# Altium schematic sheet WMM 05 Main Scheme.SchDoc
size A3; Date: Not used; ApprovedBy: Not used; CheckedBy: Not used; Author: Not used; CompanyName: VR; DrawnBy: Not used; Engineer: Not used; Organization: Not used; Address1: Not used; Address2: Not used; Address3: Not used; Address4: Not used; DocumentNumber: 6; Revision: Not used; SheetNumber: 6; SheetTotal: 9; Time: Not used; ImagePath: Not used; Application_BuildNumber: Not used
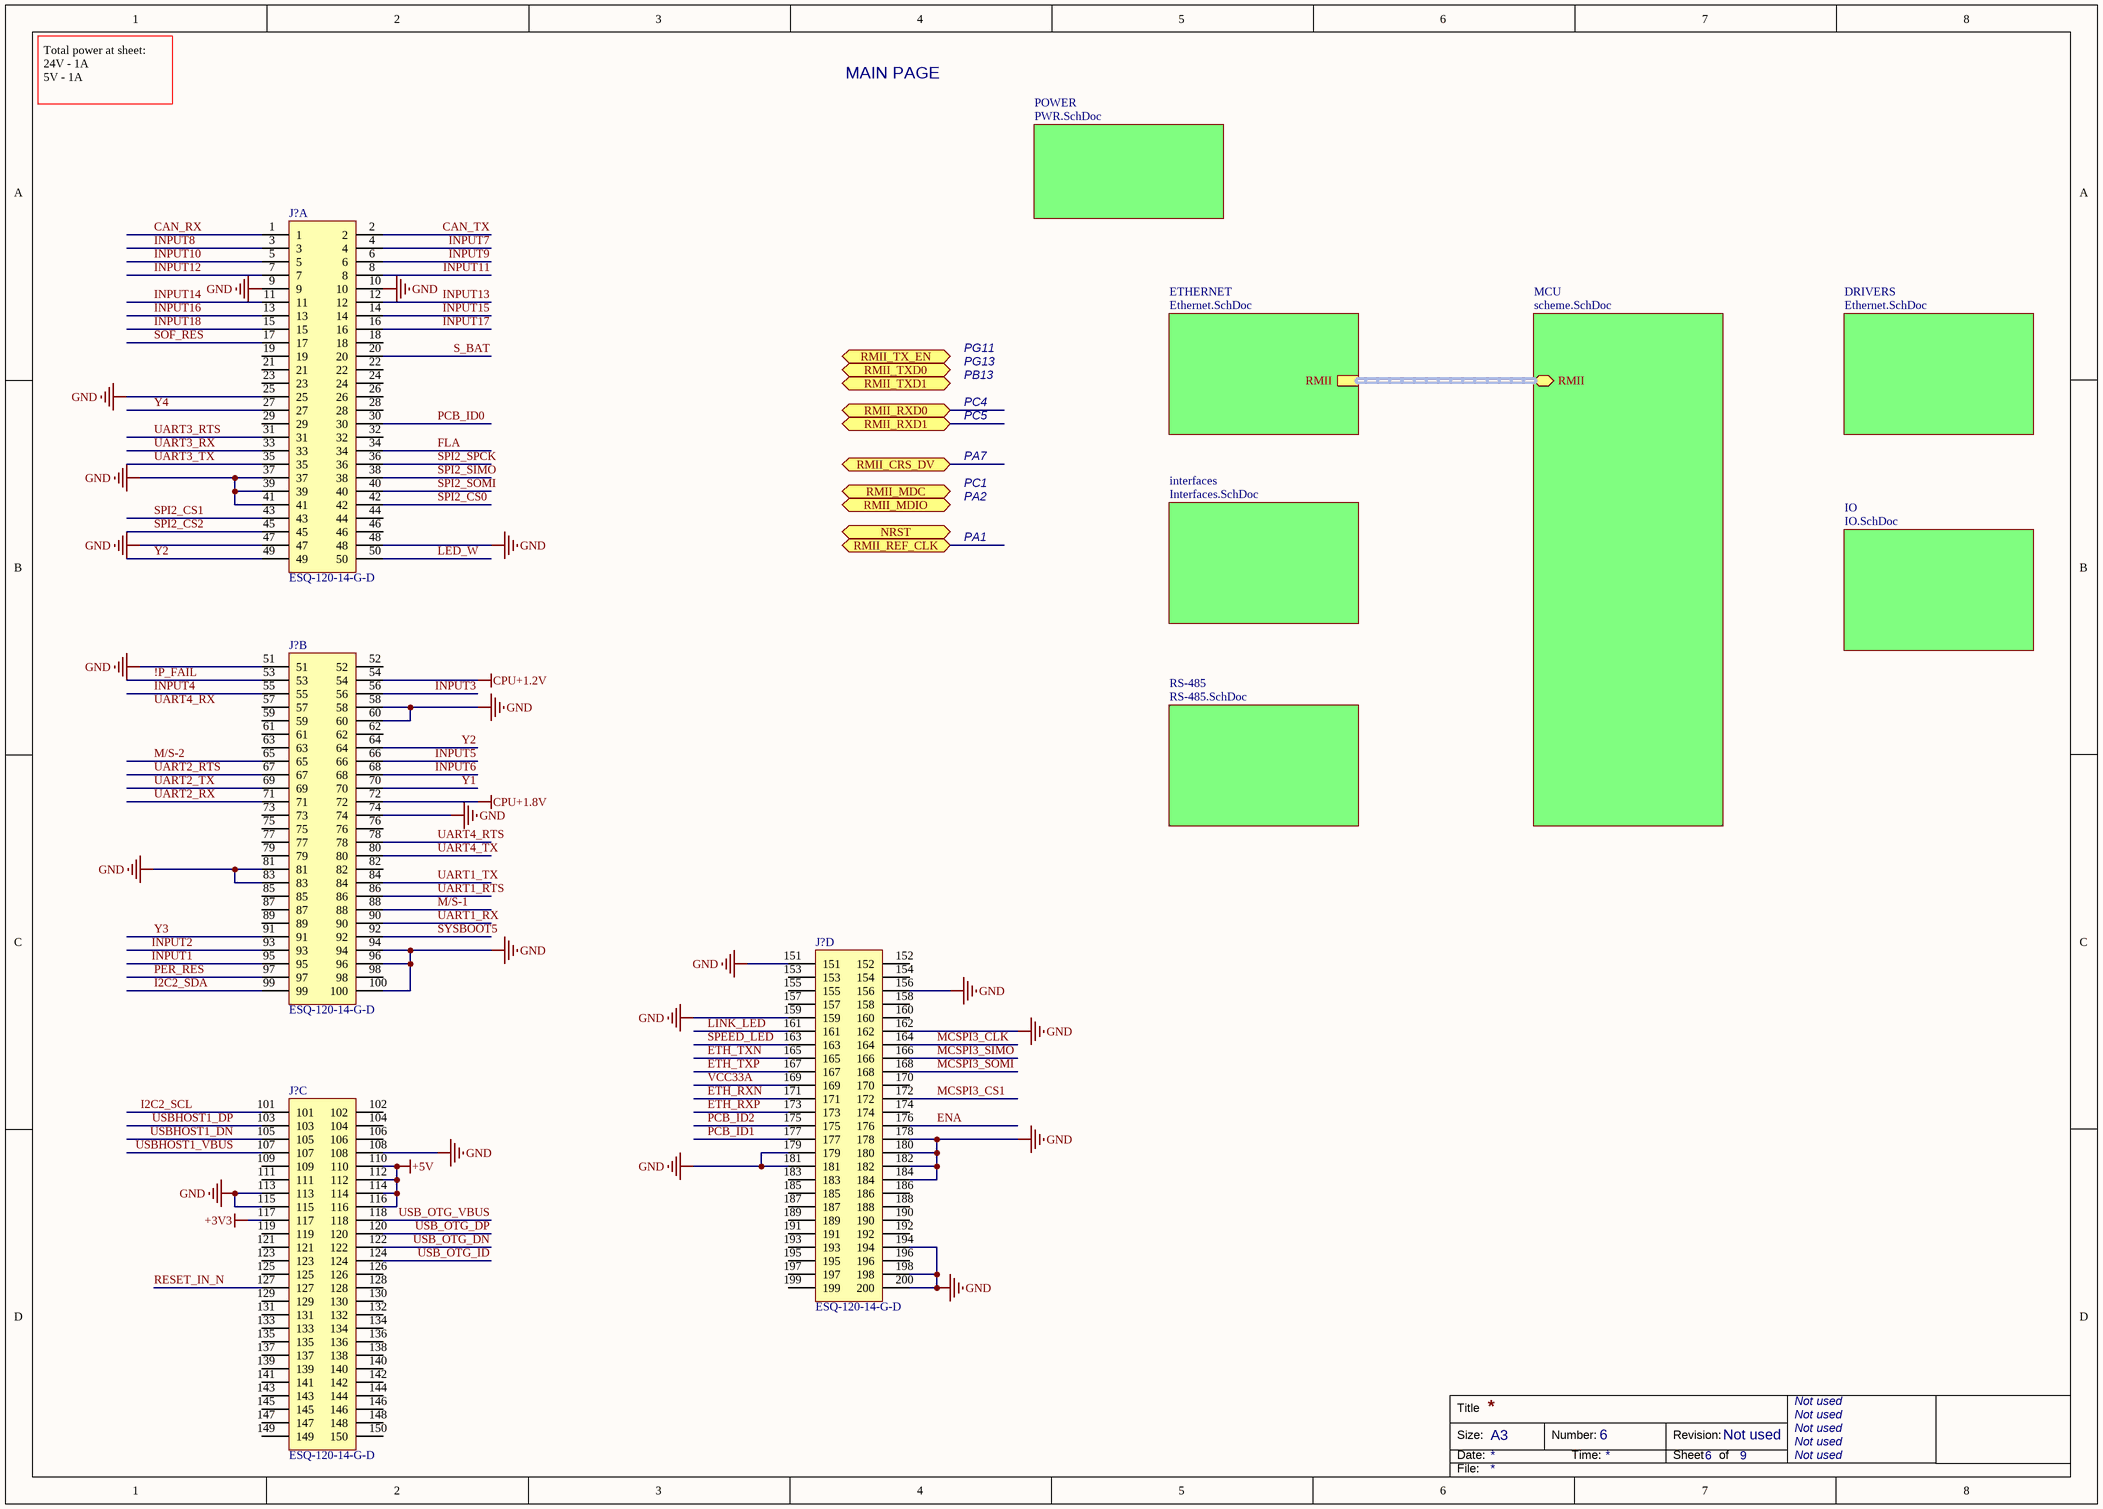
[diagram p0: WMM 05 Main Scheme.SchDoc]

## Parts
(Parts that share a designator on the sheet are numbered #1, #2 ... from top to bottom, then left to right.)
J?#1  ESQ-120-14-G-D  [SODIMM_200]  (part A of 4)
J?#2  ESQ-120-14-G-D  [SODIMM_200]  (part B of 4)
J?#3  ESQ-120-14-G-D  [SODIMM_200]  (part D of 4)
J?#4  ESQ-120-14-G-D  [SODIMM_200]  (part C of 4)

## Sub-sheets
DRIVERS = Ethernet.SchDoc: no entries
ETHERNET = Ethernet.SchDoc: RMII
interfaces = Interfaces.SchDoc: no entries
IO = IO.SchDoc: no entries
MCU = scheme.SchDoc: RMII (bidir)
POWER = PWR.SchDoc: no entries
RS-485 = RS-485.SchDoc: no entries

## Ports
NRST (bidir), RMII_CRS_DV (bidir), RMII_MDC (bidir), RMII_MDIO (bidir), RMII_REF_CLK (bidir), RMII_RXD0 (bidir), RMII_RXD1 (bidir), RMII_TX_EN (bidir), RMII_TXD0 (bidir), RMII_TXD1 (bidir)

## Nets
+3V3: J?#4.117
+5V: J?#4.110 J?#4.112 J?#4.114 J?#4.116
CPU+1.2V: J?#2.54
CPU+1.8V: J?#2.72
GND: J?#1.9 J?#1.10 J?#1.25 J?#1.37 J?#1.39 J?#1.41 J?#1.47 J?#1.48 J?#2.51 J?#2.58 J?#2.60 J?#2.74 J?#2.81 J?#2.83 J?#2.94 J?#2.96 J?#2.100 J?#3.151 J?#3.156 J?#3.159 J?#3.162 J?#3.178 J?#3.179 J?#3.180 J?#3.181 J?#3.182 J?#3.184 J?#3.194 J?#3.198 J?#3.200 J?#4.108 J?#4.113 J?#4.115
!P_FAIL: J?#2.53
CAN_RX: J?#1.1
CAN_TX: J?#1.2
ENA: J?#3.176
ETH_RXN: J?#3.171
ETH_RXP: J?#3.173
ETH_TXN: J?#3.165
ETH_TXP: J?#3.167
FLA: J?#1.34
I2C2_SCL: J?#4.101
I2C2_SDA: J?#2.99
INPUT1: J?#2.95
INPUT2: J?#2.93
INPUT3: J?#2.56
INPUT4: J?#2.55
INPUT5: J?#2.66
INPUT6: J?#2.68
INPUT7: J?#1.4
INPUT8: J?#1.3
INPUT9: J?#1.6
INPUT10: J?#1.5
INPUT11: J?#1.8
INPUT12: J?#1.7
INPUT13: J?#1.12
INPUT14: J?#1.11
INPUT15: J?#1.14
INPUT16: J?#1.13
INPUT17: J?#1.16
INPUT18: J?#1.15
LED_W: J?#1.50
LINK_LED: J?#3.161
M/S-1: J?#2.88
M/S-2: J?#2.65
MCSPI3_CLK: J?#3.164
MCSPI3_CS1: J?#3.172
MCSPI3_SIMO: J?#3.166
MCSPI3_SOMI: J?#3.168
PCB_ID0: J?#1.30
PCB_ID1: J?#3.177
PCB_ID2: J?#3.175
PER_RES: J?#2.97
RESET_IN_N: J?#4.127
S_BAT: J?#1.20
SOF_RES: J?#1.17
SPEED_LED: J?#3.163
SPI2_CS0: J?#1.42
SPI2_CS1: J?#1.43
SPI2_CS2: J?#1.45
SPI2_SIMO: J?#1.38
SPI2_SOMI: J?#1.40
SPI2_SPCK: J?#1.36
SYSBOOT5: J?#2.92
UART1_RTS: J?#2.86
UART1_RX: J?#2.90
UART1_TX: J?#2.84
UART2_RTS: J?#2.67
UART2_RX: J?#2.71
UART2_TX: J?#2.69
UART3_RTS: J?#1.31
UART3_RX: J?#1.33
UART3_TX: J?#1.35
UART4_RTS: J?#2.78
UART4_TX: J?#2.80
USB_OTG_DN: J?#4.122
USB_OTG_DP: J?#4.120
USB_OTG_ID: J?#4.124
USB_OTG_VBUS: J?#4.118
USBHOST1_DN: J?#4.105
USBHOST1_DP: J?#4.103
USBHOST1_VBUS: J?#4.107
VCC33A: J?#3.169
Y1: J?#2.70
Y2: J?#1.49 J?#2.64
Y3: J?#2.91
Y4: J?#1.27

Not connected (* = marked no-connect by the designer): J?#1 18 19 21 22 23 24 26 28 29 32 44 46; J?#2 52 57 59 61 62 63 73 75 76 77 79 82 85 87 89 98; J?#3 152 153 154 155 157 158 160 170 174 183 185 186 187 188 189 190 191 192 193 195 196 197 199; J?#4 102 104 106 109 111 119 121 123 125 126 128 129 130 131 132 133 134 135 136 137 138 139 140 141 142 143 144 145 146 147 148 149 150

## Buses and harness runs
harness sheet ETHERNET/RMII = sheet MCU/RMII

## Notes on the sheet
- Total power at sheet:
  24V - 1A
  5V - 1A
- MAIN PAGE
- PG11
- PG13
- PB13
- PC4
- PC5
- PA7
- PC1
- PA2
- PA1
- Labels drawn without touching a wire or pin: UART4_RX
- Title
- Size:
- Date:
- A3
- Number:
- Time:
- Revision:
- Sheet
- of
- File:

## Library data of the parts
J?#1-J?#4 = SODIMM-SOCKET: CONN RCPT 40POS .100" DUAL GOLD; Manufacturer: TE Connectivity; Manufacturer Part Number: 1717254-4; Connector Type: Receptacle; Number of Positions: 200; Number of Positions Loaded: All; Pitch: 0.100" (2.54mm); .Creator: MM; Supplier 1: Digi-Key; RoHS: RoHS Compliant; Category: Connectors, Interconnects; Stock 1: 51; Pricing 1: 1=7.42, 10=6.864, 50=6.1586, 100=5.7505, 250=5.00852, 500=4.823, 1000=4.6375, 2500=4.452 (USD); Packaging: Tape & Reel; Contact Type: Female Socket; Number of Rows: 2; Row Spacing: 0.100" (2.54mm); Mounting Type: Through Hole; Termination: Solder; Fastening Type: -; Features: -; Contact Finish: Gold; Contact Finish Thickness: 20µin (0.51µm); Color: Black; ComponentLink1URL: https://www.te.com/usa-en/product-1717254-4.html; ComponentLink1Description: DataSheet; Supplier Part Number 1: SAM8767-ND; .Checked PCB: MM; .Checked SCH: MM